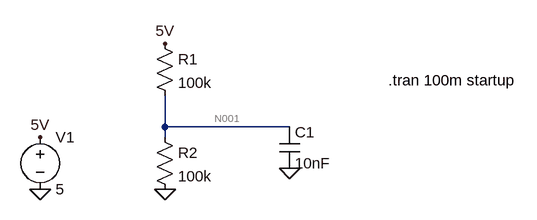
[diagram p0: schematic Draft2.asc]
Draft2.asc, the LTspice schematic file:
Version 4
SHEET 1 888 680
WIRE 336 416 336 368
WIRE 528 416 336 416
WIRE 336 432 336 416
FLAG 336 288 5V
FLAG 336 512 0
FLAG 528 480 0
FLAG 144 512 0
FLAG 144 432 5V
SYMBOL res 320 272 R0
SYMATTR InstName R1
SYMATTR Value 100k
SYMBOL res 320 416 R0
SYMATTR InstName R2
SYMATTR Value 100k
SYMBOL Cap 512 416 R0
SYMATTR InstName C1
SYMATTR Value 10nF
SYMBOL voltage 144 416 R0
SYMATTR InstName V1
SYMATTR Value 5
TEXT 680 344 Left 2 !.tran 100m startup

The netlist it stands for:
* Draft2.asc
R1 5V N001 100k
R2 N001 0 100k
C1 N001 0 10nF
V1 5V 0 5
.tran 100m startup
.backanno
.end

* Results of the author's LTspice run, read from the files saved beside the schematic
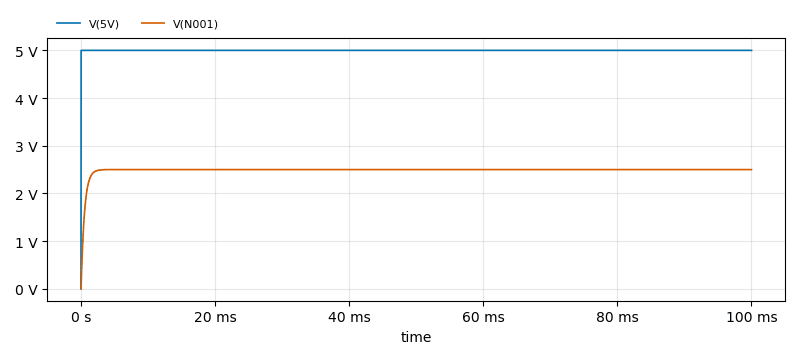
[diagram p1: Transient Analysis of Draft2.asc, plotted from the saved traces]
* Transient Analysis, 1 run:
*   V(5V): min 0 V, max 5 V, average 5 V, rms 5 V, last 5 V
*   V(N001): min 0 V, max 2.5 V, average 2.487 V, rms 2.49 V, last 2.5 V